# EAGLE design mx25u1633f-breakout (EAGLE 9.6.2)
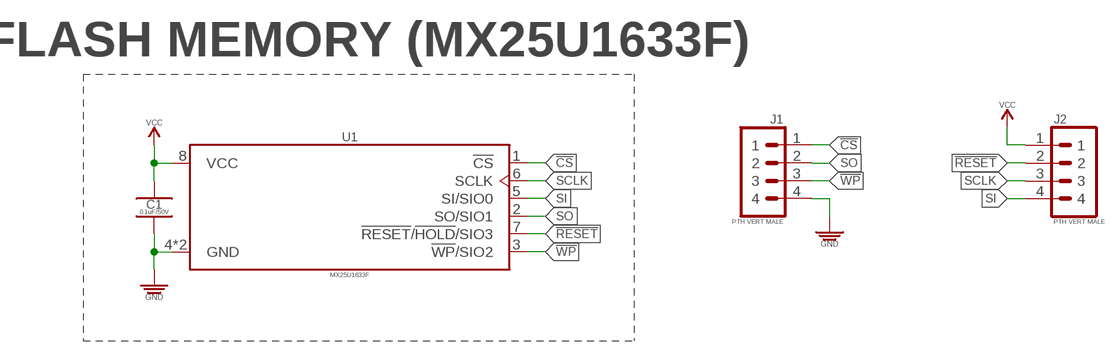
[diagram p0: schematic, sheet 1]

## Parts
C1  0.1uF/50V  0.1UF_SMD-0402_50V-10%  [CAPC1005X55_SMD-0402]
J1  PTH VERT MALE  1X04_PTH_VERT_MALE_2.54MM  [HDRV4W64P254_1X4_1016X254X838B]
J2  PTH VERT MALE  1X04_PTH_VERT_MALE_2.54MM  [HDRV4W64P254_1X4_1016X254X838B]
U1  MX25U1633F  [SON50P300X200X55-9T20X160N]

## Nets
!CS!: J1.1 U1.1(!CS)
!RESET!: J2.2 U1.7(!RESET!/!HOLD!/SIO3)
!WP!: J1.3 U1.3(!WP!/SIO2)
GND: C1.2 J1.4 U1.4(GND) U1.EP(GND)
SCLK: J2.3 U1.6(SCLK)
SI: J2.4 U1.5(SI/SIO0)
SO: J1.2 U1.2(SO/SIO1)
VCC: C1.1 J2.1 U1.8(VCC)

## Notes on the sheet
- FLASH MEMORY (MX25U1633F)

## Library data of the parts
C1 = _capacitors:0.1UF; DATASHEET: https://product.tdk.com/info/en/catalog/datasheets/mlcc_commercial_soft_en.pdf; DIST: Digikey; DISTLINK: https://www.digikey.com/products/en?keywords=445-173610-1-ND; DISTPN: 445-173610-1-ND; MFR: TDK Corporation; MPN: C1005X7R1H104K050BE
J1 J2 = _connectors:1X04; DATASHEET: https://drawings-pdf.s3.amazonaws.com/C10436.pdf; DIST: Digikey; DISTLINK: https://www.digikey.com/products/en?keywords=PEC04SAAN; DISTPN: S1012E-04-ND; MFR: Sullins Connector Solutions; MPN: PEC04SAAN
U1 = _special:MX25U1633F; DATASHEET: https://www.macronix.com/Lists/Datasheet/Attachments/7761/MX25U1633F,%201.8V,%2016Mb,%20v1.2.pdf; DIST: Digikey; DISTLINK: https://www.digikey.com/en/products/detail/macronix/MX25U1633FZUI/10059509?s=N4IgTCBcDaIIwAYCcYC0BZAGmArAVTgDYBmYgMQC08BJAYQBVUA5AERAF0BfIA; DISTPN: 1092-MX25U1633FZUICT-ND; MFR: Macronix; MPN: MX25U1633FZUI

## Board
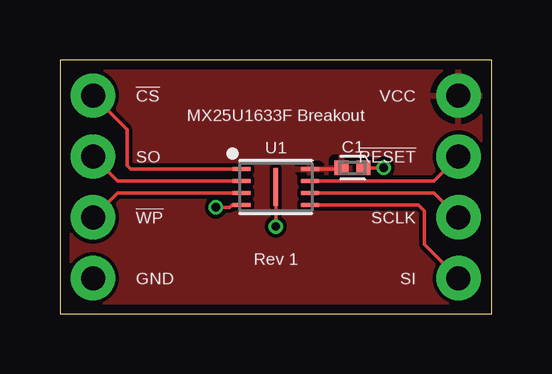
[diagram p1: board, top side]
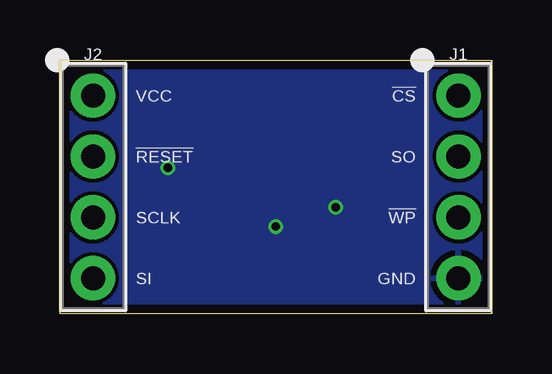
[diagram p2: board, bottom side, seen from below]

Size 18 x 10.6 mm. Coordinates in mm from the lower left corner, seen from the top.
Outline: 0,0 18,0 18,10.6 0,10.6 0,0
Copper layers (1*16): Top 0.035559375mm / dielectric 1.6mm / Bottom 0.035559375mm
Design rules "oshpark-2layer": minimum track width 6mil, minimum drill 10mil, track to track 6mil, track to pad 6mil, pad to pad 6mil, via to via 6mil, smd to smd 6mil, copper to edge 15mil, drill to drill 6mil, minimum pad ring 5mil, minimum via ring 5mil, stop-mask expansion 2.5mil, vias tented up to drill 0mil, thermal gap 10mil

### Footprints (pad centres in the part's own frame; a part is rotated, then mirrored left to right if it is on the bottom)
CAPC1005X55_SMD-0402 = smd 0.585 x 0.612: 1 -0.458,0; 2 0.458,0
HDRV4W64P254_1X4_1016X254X838B = drill 1 pad 1.85: 1 -3.81,0; 2 -1.27,0; 3 1.27,0; 4 3.81,0
SON50P300X200X55-9T20X160N = smd 0.75 x 0.17: 1 -1.425,0.75; 2 -1.425,0.25; 3 -1.425,-0.25; 4 -1.425,-0.75; 5 1.425,-0.75; 6 1.425,-0.25; 7 1.425,0.25; 8 1.425,0.75 | smd 0.2 x 1.6: EP 0,0

### Placement (x,y rotation side)
C1  12.2,6.1 0 top
J1  1.38,5.3 270 bottom
J2  16.62,5.3 270 bottom
U1  9,5.3 0 top

### Tracks (layer width: path | path; a pad name or v marks a point on that pad's centre or on a via)
!CS!
  Top 0.152: J1.1 2.8,7.69 2.8,6.2 2.95,6.05 U1.1
!RESET!
  Top 0.152: J2.2 15.6,5.55 U1.7
!WP!
  Top 0.152: J1.3 2.4,5.05 U1.3
GND  (via drill 0.35 pad 0.15)
  Top 0.152: C1.2 v13.5,6.1 | U1.4 7.17,4.55 7.08,4.45 v6.5,4.45 | U1.EP v9,3.65
  pour Bottom (rank 6): 0,0 18,0 18,10.6 0,10.6
SCLK
  Top 0.152: J2.3 15.6,5.05 U1.6
SI
  Top 0.152: J2.4 15.2,2.91 15.2,4.3 14.95,4.55 U1.5
SO
  Top 0.152: J1.2 2.4,5.55 U1.2
VCC
  Top 0.152: U1.8 10.85,6.05 11.69,6.05 C1.1
  pour Top (rank 6): 0,0 18,0 18,10.6 0,10.6

### Text on the board
tPlace: !CS! | VCC | MX25U1633F Breakout | SO | !RESET! | !WP! | SCLK | Rev 1 | GND | SI
bPlace: !CS! | VCC | SO | !RESET! | !WP! | SCLK | GND | SI